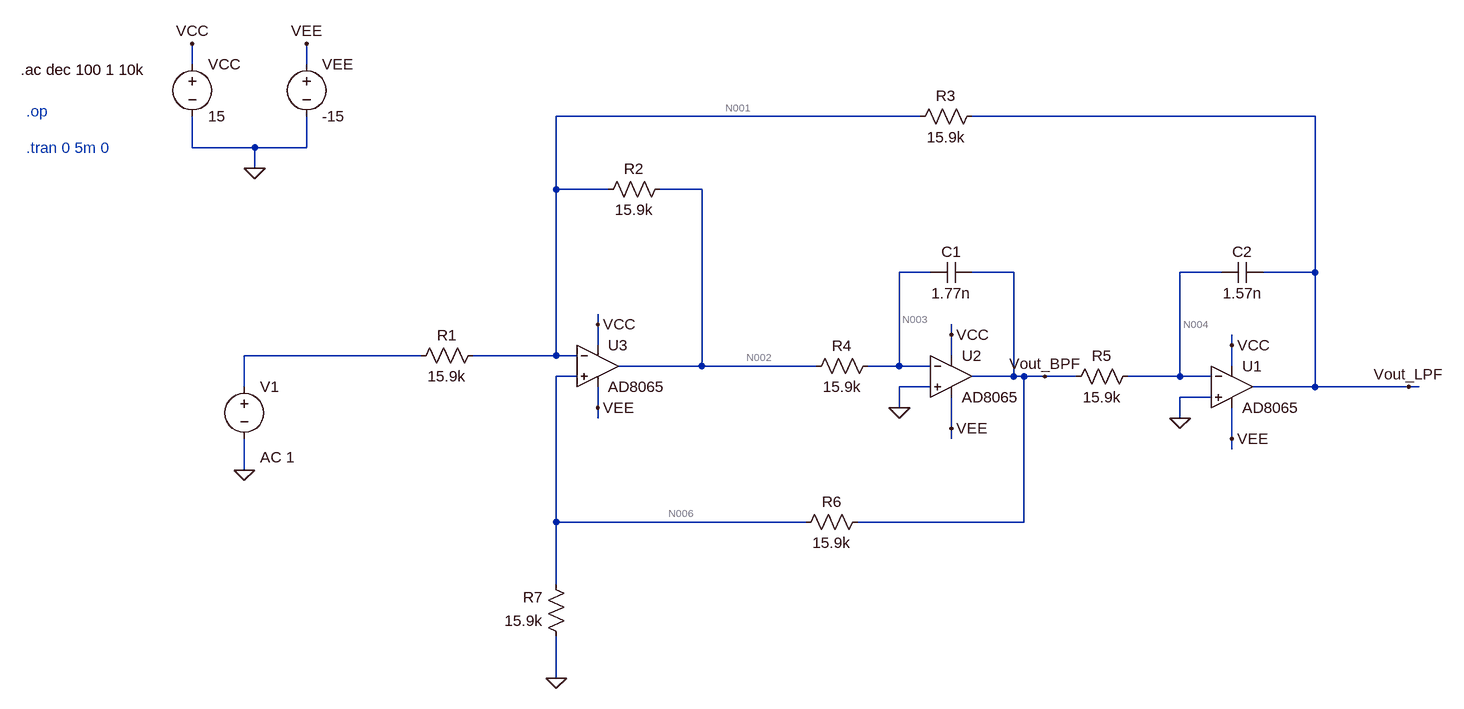
[diagram p0: schematic etaj2.asc]
etaj2.asc, the LTspice schematic file:
Version 4
SHEET 1 2396 2132
WIRE 400 -32 400 -64
WIRE 576 -32 576 -64
WIRE 1520 48 960 48
WIRE 2128 48 1600 48
WIRE 400 96 400 48
WIRE 496 96 400 96
WIRE 576 96 576 48
WIRE 576 96 496 96
WIRE 496 128 496 96
WIRE 960 160 960 48
WIRE 1040 160 960 160
WIRE 1184 160 1120 160
WIRE 1536 288 1488 288
WIRE 1664 288 1600 288
WIRE 1984 288 1920 288
WIRE 2128 288 2128 48
WIRE 2128 288 2048 288
WIRE 1024 368 1024 352
WIRE 1568 384 1568 368
WIRE 1024 400 1024 368
WIRE 2000 400 2000 384
WIRE 752 416 480 416
WIRE 960 416 960 160
WIRE 960 416 832 416
WIRE 992 416 960 416
WIRE 1568 416 1568 384
WIRE 1184 432 1184 160
WIRE 1184 432 1056 432
WIRE 1360 432 1184 432
WIRE 1488 432 1488 288
WIRE 1488 432 1440 432
WIRE 1536 432 1488 432
WIRE 2000 432 2000 400
WIRE 992 448 960 448
WIRE 1664 448 1664 288
WIRE 1664 448 1600 448
WIRE 1680 448 1664 448
WIRE 1712 448 1680 448
WIRE 1760 448 1712 448
WIRE 1920 448 1920 288
WIRE 1920 448 1840 448
WIRE 1968 448 1920 448
WIRE 480 464 480 416
WIRE 1536 464 1488 464
WIRE 2128 464 2128 288
WIRE 2128 464 2032 464
WIRE 2272 464 2128 464
WIRE 2288 464 2272 464
WIRE 1968 480 1920 480
WIRE 1024 496 1024 464
WIRE 1488 496 1488 464
WIRE 1024 512 1024 496
WIRE 1920 512 1920 480
WIRE 1568 528 1568 480
WIRE 1568 544 1568 528
WIRE 2000 544 2000 496
WIRE 2000 560 2000 544
WIRE 480 592 480 544
WIRE 960 672 960 448
WIRE 1344 672 960 672
WIRE 1680 672 1680 448
WIRE 1680 672 1424 672
WIRE 960 768 960 672
WIRE 960 912 960 848
FLAG 400 -64 VCC
FLAG 576 -64 VEE
FLAG 960 912 0
FLAG 1488 496 0
FLAG 1920 512 0
FLAG 480 592 0
FLAG 496 128 0
FLAG 1024 368 VCC
FLAG 1568 384 VCC
FLAG 2000 400 VCC
FLAG 1024 496 VEE
FLAG 1568 528 VEE
FLAG 2000 544 VEE
FLAG 2272 464 Vout_LPF
FLAG 1712 448 Vout_BPF
SYMBOL voltage 400 -48 R0
WINDOW 123 0 0 Left 2
WINDOW 39 0 0 Left 2
SYMATTR InstName VCC
SYMATTR Value 15
SYMBOL voltage 576 -48 R0
WINDOW 123 0 0 Left 2
WINDOW 39 0 0 Left 2
SYMATTR InstName VEE
SYMATTR Value -15
SYMBOL res 848 400 R90
WINDOW 0 0 56 VBottom 2
WINDOW 3 32 56 VTop 2
SYMATTR InstName R1
SYMATTR Value 15.9k
SYMBOL res 1136 144 R90
WINDOW 0 0 56 VBottom 2
WINDOW 3 32 56 VTop 2
SYMATTR InstName R2
SYMATTR Value 15.9k
SYMBOL res 1456 416 R90
WINDOW 0 0 56 VBottom 2
WINDOW 3 32 56 VTop 2
SYMATTR InstName R4
SYMATTR Value 15.9k
SYMBOL res 1856 432 R90
WINDOW 0 0 56 VBottom 2
WINDOW 3 32 56 VTop 2
SYMATTR InstName R5
SYMATTR Value 15.9k
SYMBOL cap 1600 272 R90
WINDOW 0 0 32 VBottom 2
WINDOW 3 32 32 VTop 2
SYMATTR InstName C1
SYMATTR Value 1.77n
SYMBOL voltage 480 448 R0
WINDOW 123 24 124 Left 2
WINDOW 39 0 0 Left 0
WINDOW 3 24 44 Left 2
SYMATTR Value2 AC 1
SYMATTR Value ""
SYMATTR InstName V1
SYMBOL res 1616 32 R90
WINDOW 0 0 56 VBottom 2
WINDOW 3 32 56 VTop 2
SYMATTR InstName R3
SYMATTR Value 15.9k
SYMBOL cap 2048 272 R90
WINDOW 0 0 32 VBottom 2
WINDOW 3 32 32 VTop 2
SYMATTR InstName C2
SYMATTR Value 1.57n
SYMBOL res 1440 656 R90
WINDOW 0 0 56 VBottom 2
WINDOW 3 32 56 VTop 2
SYMATTR InstName R6
SYMATTR Value 15.9k
SYMBOL res 976 864 R180
WINDOW 0 36 76 Left 2
WINDOW 3 36 40 Left 2
SYMATTR InstName R7
SYMATTR Value 15.9k
SYMBOL OpAmps\\AD8065 2000 400 R0
SYMATTR InstName U1
SYMBOL OpAmps\\AD8065 1568 384 R0
SYMATTR InstName U2
SYMBOL OpAmps\\AD8065 1024 368 R0
SYMATTR InstName U3
TEXT 136 -24 Left 2 !.ac dec 100 1 10k
TEXT 144 40 Left 2 ;.op
TEXT 144 96 Left 2 ;.tran 0 5m 0

The netlist it stands for:
* etaj2.asc
VCC VCC 0 15
VEE VEE 0 -15
R1 N001 N005 15.9k
R2 N002 N001 15.9k
R4 N003 N002 15.9k
R5 N004 Vout_BPF 15.9k
C1 Vout_BPF N003 1.77n
V1 N005 0 AC 1
R3 Vout_LPF N001 15.9k
C2 Vout_LPF N004 1.57n
R6 Vout_BPF N006 15.9k
R7 0 N006 15.9k
XU1 0 N004 VCC VEE Vout_LPF AD8065  ; pins In+ In- V+ V- OUT
XU2 0 N003 VCC VEE Vout_BPF AD8065  ; pins In+ In- V+ V- OUT
XU3 N006 N001 VCC VEE N002 AD8065  ; pins In+ In- V+ V- OUT
.ac dec 100 1 10k
* .op
* .tran 0 5m 0
.backanno
.end

* Results of the author's LTspice run, read from the files saved beside the schematic
* Operating Point, zero values left out:
*   V(vcc) = 15 V
*   V(vee) = -15 V
*   V(n001) = -600 µV
*   V(n002) = -400 µV
*   V(n003) = -400 µV
*   V(n004) = -400 µV
*   V(vout_bpf) = -400 µV
*   V(vout_lpf) = -1.4 mV
*   V(n006) = -200 µV
*   I(R1) = -37.73 nA
*   I(R2) = 12.58 nA
*   I(R4) = 1.04 pA
*   I(R5) = 1.04 pA
*   I(R3) = -50.31 nA
*   I(R6) = -12.58 nA
*   I(R7) = 12.58 nA
*   I(Vcc) = -19.2 mA
*   I(Vee) = 19.2 mA
*   I(V1) = -37.73 nA
*   Ix(u1:100) = -3.04 pA
*   Ix(u1:101) = -1.04 pA
*   Ix(u1:102) = 6.402 mA
*   Ix(u1:103) = -6.402 mA
*   Ix(u1:104) = 50.31 nA
*   Ix(u2:100) = -3.04 pA
*   Ix(u2:101) = -1.04 pA
*   Ix(u2:102) = 6.402 mA
*   Ix(u2:103) = -6.402 mA
*   Ix(u2:104) = 12.58 nA
*   Ix(u3:100) = -3.06 pA
*   Ix(u3:101) = -1.06 pA
*   Ix(u3:102) = 6.402 mA
*   Ix(u3:103) = -6.402 mA
*   Ix(u3:104) = -12.58 nA
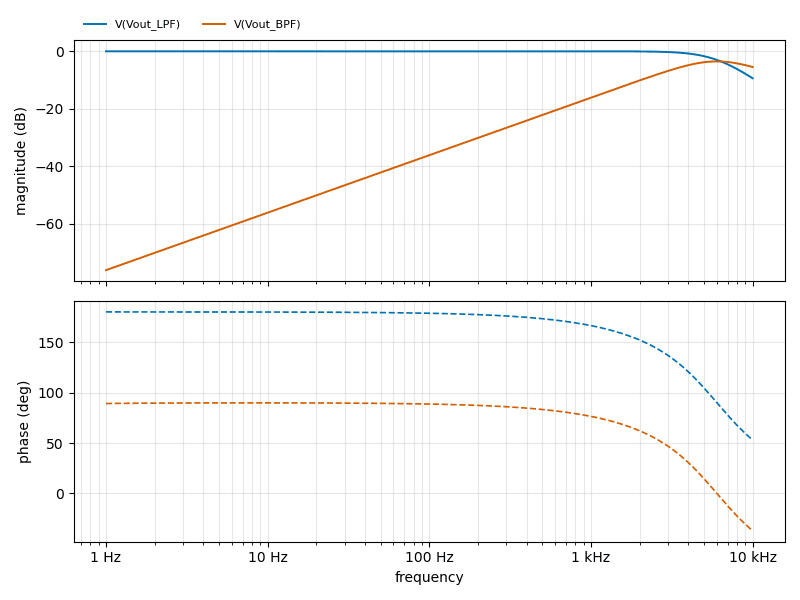
[diagram p1: AC Analysis of etaj2.asc, plotted from the saved traces]
* AC Analysis, 1 run:
*   V(Vout_LPF): -0.00 dB at 1 Hz, -9.38 dB at 10 kHz, peak -0.00 dB at 275.4 Hz, 3 dB below the peak at 6.012 kHz
*   V(Vout_BPF): -76.09 dB at 1 Hz, -5.47 dB at 10 kHz, peak -3.52 dB at 6.026 kHz, 3 dB below the peak at 3.111 kHz